# Altium schematic sheet rejestrator_trasy.SchDoc
size A4
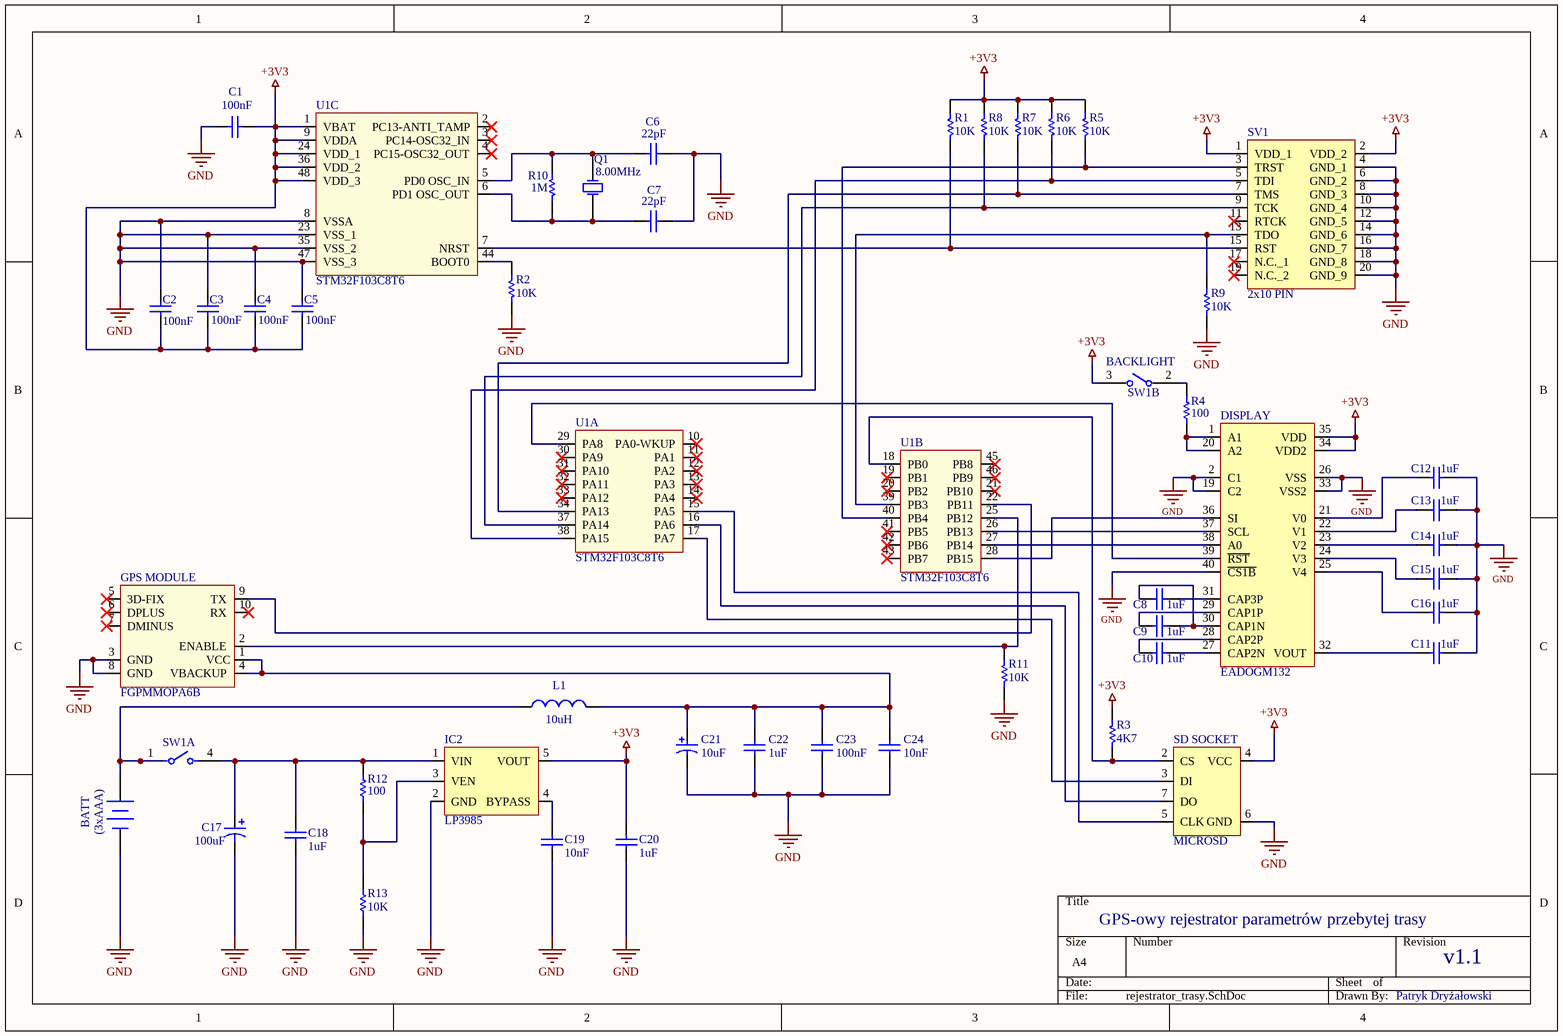
[diagram p0: rejestrator_trasy.SchDoc]

## Parts
2x10_PIN  SV1  [GOLDPIN 2x10 SMD]
BATT  (3xAAA)  [BAT-2]
C1  value 100nF  [CAPC0805(2012)75_N]  (hidden comment: CAP 100nF 25V 0805(2012))
C2  value 100nF  [CAPC0805(2012)75_N]  (hidden comment: CAP 100nF 25V 0805(2012))
C3  value 100nF  [CAPC0805(2012)75_N]  (hidden comment: CAP 100nF 25V 0805(2012))
C4  value 100nF  [CAPC0805(2012)75_N]  (hidden comment: CAP 100nF 25V 0805(2012))
C5  value 100nF  [CAPC0805(2012)75_N]  (hidden comment: CAP 100nF 25V 0805(2012))
C6  value 22pF  [CAPC0805(2012)100_M]  (hidden comment: CAP 22pF 10V 0805(2012))
C7  value 22pF  [CAPC0805(2012)100_M]  (hidden comment: CAP 22pF 10V 0805(2012))
C8  value 1uF  [CAPC0805(2012)145_M]  (hidden comment: CAP 1uF 10V 0805(2012))
C9  value 1uF  [CAPC0805(2012)145_M]  (hidden comment: CAP 1uF 10V 0805(2012))
C10  value 1uF  [CAPC0805(2012)145_M]  (hidden comment: CAP 1uF 10V 0805(2012))
C11  value 1uF  [CAPC0805(2012)145_M]  (hidden comment: CAP 1uF 10V 0805(2012))
C12  value 1uF  [CAPC0805(2012)145_M]  (hidden comment: CAP 1uF 10V 0805(2012))
C13  value 1uF  [CAPC0805(2012)145_M]  (hidden comment: CAP 1uF 10V 0805(2012))
C14  value 1uF  [CAPC0805(2012)145_M]  (hidden comment: CAP 1uF 10V 0805(2012))
C15  value 1uF  [CAPC0805(2012)145_M]  (hidden comment: CAP 1uF 10V 0805(2012))
C16  value 1uF  [CAPC0805(2012)145_M]  (hidden comment: CAP 1uF 10V 0805(2012))
C17  value 100uF  [C0805]  (hidden comment: Cap Pol3)
C18  value 1uF  [CAPC0805(2012)145_M]  (hidden comment: CAP 1uF 10V 0805(2012))
C19  value 10nF  [CAPC0805(2012)75_N]  (hidden comment: CAP 10nF 16V 0805(2012))
C20  value 1uF  [CAPC0805(2012)145_M]  (hidden comment: CAP 1uF 10V 0805(2012))
C21  Capacitance: 10uF  [CAPPR55-200-1100X500X1200]  (hidden comment: ECA1HM100)
C22  value 1uF  [CAPC0805(2012)145_M]  (hidden comment: CAP 1uF 10V 0805(2012))
C23  value 100nF  [CAPC0805(2012)75_N]  (hidden comment: CAP 100nF 25V 0805(2012))
C24  value 10nF  [CAPC0805(2012)75_N]  (hidden comment: CAP 10nF 16V 0805(2012))
DISPLAY  EADOGM132  [EA DOGM132]
GPS_MODULE  FGPMMOPA6B  [GTPA010]
IC2  LP3985  [SOT-23]
L1  Inductance: 10uH  [INDC2013X140X50LL20T20]  (hidden comment: BRC2012T2R2MD)
Q1  Frequency: 8.00MHz  [TXC-9C-2_V]  (hidden comment: Quartz)
R1  value 10K  [RESC0805(2012)_L]  (hidden comment: 10K 5% 0805(2012))
R2  value 10K  [RESC0805(2012)_L]  (hidden comment: 10K 5% 0805(2012))
R3  value 4K7  [RESC0805(2012)_N]  (hidden comment: 4K7 5% 0805(2012))
R4  value 100  [RESC0805(2012)_M]  (hidden comment: 100R 5% 0805(2012))
R5  value 10K  [RESC0805(2012)_L]  (hidden comment: 10K 5% 0805(2012))
R6  value 10K  [RESC0805(2012)_L]  (hidden comment: 10K 5% 0805(2012))
R7  value 10K  [RESC0805(2012)_L]  (hidden comment: 10K 5% 0805(2012))
R8  value 10K  [RESC0805(2012)_L]  (hidden comment: 10K 5% 0805(2012))
R9  value 10K  [RESC0805(2012)_L]  (hidden comment: 10K 5% 0805(2012))
R10  value 1M  [RESC0805(2012)_L]  (hidden comment: 1M 5% 0805(2012))
R11  value 10K  [RESC0805(2012)_L]  (hidden comment: 10K 5% 0805(2012))
R12  value 100  [RESC0805(2012)_M]  (hidden comment: 100R 5% 0805(2012))
R13  value 10K  [RESC0805(2012)_L]  (hidden comment: 10K 5% 0805(2012))
SD_SOCKET  MICROSD  [SD CONN]
SW1  1825057-1  [TE_Connectivity_1825057-1_MFG]  (value not drawn)  (parts A,B of 2)
U1  STM32F103C8T6  [LQFP48]  (parts A,B,C of 3)

## Nets
+3V3: 2x10_PIN.1(VDD_1) 2x10_PIN.2(VDD_2) C1.2 C2.1 C3.1 C4.1 C5.1 C20.2 DISPLAY.34(VDD2) DISPLAY.35(VDD) IC2.5(VOUT) R1.2 R3.2 R5.2 R6.2 R7.2 R8.2 SD_SOCKET.4(VCC) SW1.3 U1.1(VBAT) U1.9(VDDA) U1.24(VDD_1) U1.36(VDD_2) U1.48(VDD_3)
GND: 2x10_PIN.4(GND_1) 2x10_PIN.6(GND_2) 2x10_PIN.8(GND_3) 2x10_PIN.10(GND_4) 2x10_PIN.12(GND_5) 2x10_PIN.14(GND_6) 2x10_PIN.16(GND_7) 2x10_PIN.18(GND_8) 2x10_PIN.20(GND_9) BATT.2(-) C1.1 C2.2 C3.2 C4.2 C5.2 C6.1 C7.1 C11.2 C12.2 C13.2 C14.2 C15.2 C16.2 C17.2 C18.1 C19.1 C20.1 C21.2 C22.1 C23.1 C24.1 DISPLAY.2(C1) DISPLAY.19(C2) DISPLAY.26(VSS) DISPLAY.33(VSS2) DISPLAY.40(~{CS1B}) GPS_MODULE.3(GND) GPS_MODULE.8(GND) IC2.2(GND) R2.1 R9.1 R11.1 R13.1 SD_SOCKET.6(GND) U1.8(VSSA) U1.23(VSS_1) U1.35(VSS_2) U1.47(VSS_3)
Net2x10_PIN_3: 2x10_PIN.3(TRST) R5.1 U1.40(PB4)
Net2x10_PIN_5: 2x10_PIN.5(TDI) R6.1 U1.38(PA15)
Net2x10_PIN_7: 2x10_PIN.7(TMS) R7.1 U1.34(PA13)
Net2x10_PIN_9: 2x10_PIN.9(TCK) R8.1 U1.37(PA14)
Net2x10_PIN_13: 2x10_PIN.13(TDO) R9.2 U1.39(PB3)
Net2x10_PIN_15: 2x10_PIN.15(RST) R1.1 U1.7(NRST)
NetBATT_1: BATT.1(+) L1.1 SW1.1
NetC6_2: C6.2 Q1.1(X1) R10.2 U1.5(PD0_OSC_IN)
NetC7_2: C7.2 Q1.2(X2) R10.1 U1.6(PD1_OSC_OUT)
NetC8_1: C8.1 C9.2 DISPLAY.30(CAP1N)
NetC8_2: C8.2 DISPLAY.31(CAP3P)
NetC9_1: C9.1 DISPLAY.29(CAP1P)
NetC10_1: C10.1 DISPLAY.28(CAP2P)
NetC10_2: C10.2 DISPLAY.27(CAP2N)
NetC11_1: C11.1 DISPLAY.32(VOUT)
NetC12_1: C12.1 DISPLAY.21(V0)
NetC13_1: C13.1 DISPLAY.22(V1)
NetC14_1: C14.1 DISPLAY.23(V2)
NetC15_1: C15.1 DISPLAY.24(V3)
NetC16_1: C16.1 DISPLAY.25(V4)
NetC17_1: C17.1 C18.2 IC2.1(VIN) R12.2 SW1.4
NetC19_2: C19.2 IC2.4(BYPASS)
NetC21_1: C21.1 C22.2 C23.2 C24.2 GPS_MODULE.1(VCC) GPS_MODULE.4(VBACKUP) L1.2
NetDISPLAY_1: DISPLAY.1(A1) DISPLAY.20(A2) R4.1
NetDISPLAY_36: DISPLAY.36(SI) U1.28(PB15)
NetDISPLAY_37: DISPLAY.37(SCL) U1.26(PB13)
NetDISPLAY_38: DISPLAY.38(A0) U1.27(PB14)
NetDISPLAY_39: DISPLAY.39(~{RST}) U1.29(PA8)
NetGPS_MODULE_2: GPS_MODULE.2(ENABLE) R11.2 U1.25(PB12)
NetGPS_MODULE_9: GPS_MODULE.9(TX) U1.22(PB11)
NetIC2_3: IC2.3(VEN) R12.1 R13.2
NetR2_2: R2.2 U1.44(BOOT0)
NetR3_1: R3.1 SD_SOCKET.2(CS) U1.18(PB0)
NetR4_2: R4.2 SW1.2
NetSD_SOCKET_3: SD_SOCKET.3(DI) U1.17(PA7)
NetSD_SOCKET_5: SD_SOCKET.5(CLK) U1.15(PA5)
NetSD_SOCKET_7: SD_SOCKET.7(DO) U1.16(PA6)

Not connected (* = marked no-connect by the designer): 2x10_PIN 11(RTCK)* 17(N.C._1)* 19(N.C._2)*; GPS_MODULE 5(3D-FIX)* 6(DPLUS)* 7(DMINUS)* 10(RX)*; U1 2(PC13-ANTI_TAMP)* 3(PC14-OSC32_IN)* 4(PC15-OSC32_OUT)* 10(PA0-WKUP)* 11(PA1)* 12(PA2)* 13(PA3)* 14(PA4)* 19(PB1)* 20(PB2)* 21(PB10)* 30(PA9)* 31(PA10)* 32(PA11)* 33(PA12)* 41(PB5)* 42(PB6)* 43(PB7)* 45(PB8)* 46(PB9)*

## Notes on the sheet
- GPS-owy rejestrator parametrów przebytej trasy
- v1.1
- Patryk Dryżałowski

## Library data of the parts
BATT = Battery: Multicell Battery; Published: 24-Mar-1999; LatestRevisionDate: 17-Jul-2002; LatestRevisionNote: Re-released for DXP Platform.; PackageReference: BAT-2; Publisher: Altium Limited; PackageDescription: Battery; 2 Leads
C1-C5 C23 = CMP-1036-04415-1: CAP 100nF 25V -20% to +80% 0805 (2012 Metric) Thickness 0.75mm SMD; Case-EIA: 0805; Case-Metric: 2012; Rated Voltage: 25 V; Tolerance: -20% to +80%; Technology: SMT; Max Thickness: 0.75 mm
C6 C7 = CMP-1036-01213-1: CAP 22pF 10V ±20% 0805 (2012 Metric) Thickness 1mm SMD; Tolerance: Â±20%; Case-Metric: 2012; Case-EIA: 0805; Technology: SMT; Rated Voltage: 10 V; Max Thickness: 1 mm
C8-C16 C18 C20 C22 = CMP-1036-04740-1: CAP 1uF 10V ±20% 0805 (2012 Metric) Thickness 1.45mm SMD; Case-Metric: 2012; Tolerance: Â±20%; Case-EIA: 0805; Technology: SMT; Rated Voltage: 10 V; Max Thickness: 1.45 mm
C17 = Cap Pol3: Polarized Capacitor (Surface Mount); Published: 8-Jun-2000; LatestRevisionDate: 29-May-2009; LatestRevisionNote: IPC-7351 Footprint Added.; PackageReference: C0805; Publisher: Altium Limited; PackageDescription: Chip Capacitor
C19 C24 = CMP-1036-03821-1: CAP 10nF 16V ±20% 0805 (2012 Metric) Thickness 0.75mm SMD; Tolerance: Â±20%; Case-Metric: 2012; Case-EIA: 0805; Technology: SMT; Max Thickness: 0.75 mm; Rated Voltage: 16 V
C21 = CMP-2100-03622-1: Aluminum Electrolytic Capacitor, 10 uF, +/- 20%, 50 V, -40 to 85 degC, 2-Pin THD, RoHS, Bulk; Manufacturer: Panasonic; Life (Hours): 2000Hour; Lead/Base Style: Straight; Dissipation Factor: 0.12%; Leakage Current: 3uA; Dielectric Material: Aluminium; Lead Diameter: 0.5mm; Voltage Rating: 50V; Ripple Current: 65mA; Package Reference: CAPPR55-200-1100X500X1200; Height: 11mm; Diameter: 5mm; REACH SVHC: NoSVHC; Mount: ThroughHole; Packaging: Bulk; Manufacturer URL: http://www.panasonic.com/; Termination: Radial; Datasheet URL: https://industrial.panasonic.com/cdbs/www-data/pdf/RDF0000/ABA0000C1218.pdf; Lead Free: LeadFree; Height - Seated (Max): 0.472inch; Case/Package: Radial; Package Description: 2-Pin Radial Lead, Dia 5 mm, Height 12 mm; Tolerance: 20%; Datasheet Version: Rev. 05, 10/2016; Package Quantity: 200; Ripple Current (AC): 65mA; Min Operating Temperature: -40degC; RoHSCompliant: true; Number of Pins: 2; Max Operating Temperature: 85degC; Voltage: 50V; Lead Pitch: 2mm; Radiation Hardening: No; Voltage Rating (DC): 50V; Length: 11mm
DISPLAY = EA DOGM132
L1 = CMP-2000-05964-1: Wire-Wound Chip Power Inductor, 2.2 uH, +/- 20%, -40 to 105 degC, 2-Pin SMD (0805), RoHS, Tape and Reel; Manufacturer: Taiyo Yuden; Other Names: 587-2905-2 / LQBRC2012T2R2MD; Type: Wirewound; Current - Saturation: 1.1A; Online Catalog: BRSeries; EDA / CAD Models: DownloadfromAcceleratedDesigns; Shielding: Unshielded; DC Resistance (DCR): 143mOhmMax; Current Rating: 1A; Frequency - Test: 1MHz; Frequency - Self Resonant: 350MHz; Series: BR; Datasheet URL: http://ds.yuden.co.jp/TYCOMPAS/ut/detail.do?productNo=BRC2012T2R2MD&fileName=BRC2012T2R2MD_SS&mode=specSheetDownload; Tolerance: ±20%; Mounting Technology: SurfaceMount; Standard Package: 2,000; Category: Inductors,Coils,Chokes; Operating Temperature: -40°C~105°C; Mounting Type: SurfaceMount; Datasheet Version: 09/2016; Package Reference: 0805; Package Description: 2-Pin Surface Mount Device, Body 2 x 1.25 mm; Packaging: Tape&Reel(TR); Package / Case: 0805(2012Metric); Family: FixedInductors; Manufacturer URL: http://www.t-yuden.com/
Q1 = CMP-0724-00001-1: 9C Series Quartz Crystal, 3.6864 MHz, +/-50 ppm, 20 pF, -40 to 85 degC, 2-Pin 11.4 x 4.8 x 4.1 mm SMD, RoHS, Tape and Reel; PartNumber: 9C-3.6864MBBK-T; Manufacturer: TXC; Load Capacitance: 20 pF; Frequency Stability (over Temp.): +/-50 ppm (-20 to 70 degC); PackageVersion: Jun-10; PackageDescription: 2-Pin SMD, Body 11.4 x 4.8 mm, Height 4.1 mm; Packing: Tape and Reel; PackageReference: 9C-2; ComponentLink2URL: http://www.txccrystal.com/images/pdf/9c.pdf; ComponentLink3URL: http://www.txccrystal.com/images/pdf/9c.pdf; Mounting Technology: Surface Mount; ComponentLink3Description: Package Specification; ComponentLink2Description: Datasheet; Frequency Tolerance (at 25 degC): +/-50 ppm; ComponentLink1URL: http://www.txccrystal.com/; RoHS: TRUE; DatasheetVersion: Jun-10; ComponentLink1Description: Manufacturer URL; Operating Temperature Range: -40 to 85 degC
R1 R2 R5-R9 R11 R13 = CMP-1013-00098-1: 10K 0.125W 5% 0805 (2012 Metric)  SMD; Case-EIA: 0805; Case-Metric: 2012; Power: 0.125 W; Technology: SMT; Tolerance: 5 %
R3 = CMP-1013-00090-1: 4K7 0.125W 5% 0805 (2012 Metric)  SMD; Case-EIA: 0805; Case-Metric: 2012; Power: 0.125 W; Tolerance: 5 %; Technology: SMT
R4 R12 = CMP-1013-00050-1: 100R 0.125W 5% 0805 (2012 Metric)  SMD; Case-EIA: 0805; Case-Metric: 2012; Tolerance: 5 %; Power: 0.125 W; Technology: SMT
R10 = CMP-1013-00146-1: 1M 0.125W 5% 0805 (2012 Metric)  SMD; Case-Metric: 2012; Case-EIA: 0805; Technology: SMT; Tolerance: 5 %; Power: 0.125 W
SW1 = CMP-03205-00126-1: SWITCH SLIDE DIP SPST 100MA 24V; Manufacturer: TE Connectivity; Number Of Circuits: 2; Contact Resistance: 50mΩ; Electromechanical Life: 1000Cycles; Standoff Height: 1.3mm; RoHS: TRUE; Contact Current Rating: 100mA; Package: 1825057-1; Temperature Range Low: -30°C; Part Number: 1825057-1; Voltage Rating Dc: 24V; Temperature: -30°C to +85°C; Height: 6.15mm; Temperature Range High: +85°C; Lead Free: Yes; Throw Configuration: SPST; Automotive: No; Mount: Through Hole; ComponentLink1URL: https://www.te.com/usa-en/product-1825057-1.html?te_bu=Cor&te_type=other&te_campaign=oct_glo_cor-oct-global-oth-prtnr-fy19-oct-octo-buy-bom_sma-298_2&elqCampaignId=35216; ComponentLink1Description: Datasheet; PartId: 1
GPS_MODULE = FGPMMOPA6B: helpURL: https://cdn-shop.adafruit.com/datasheets/PA6B-Datasheet-A07.pdf; Supplier: GlobalTop
U1 = STM32F103C8T6: helpURL: https://pdf1.alldatasheet.com/datasheet-pdf/view/201596/STMICROELECTRONICS/STM32F103C8T6.html; Supplier: STMicroelectronics